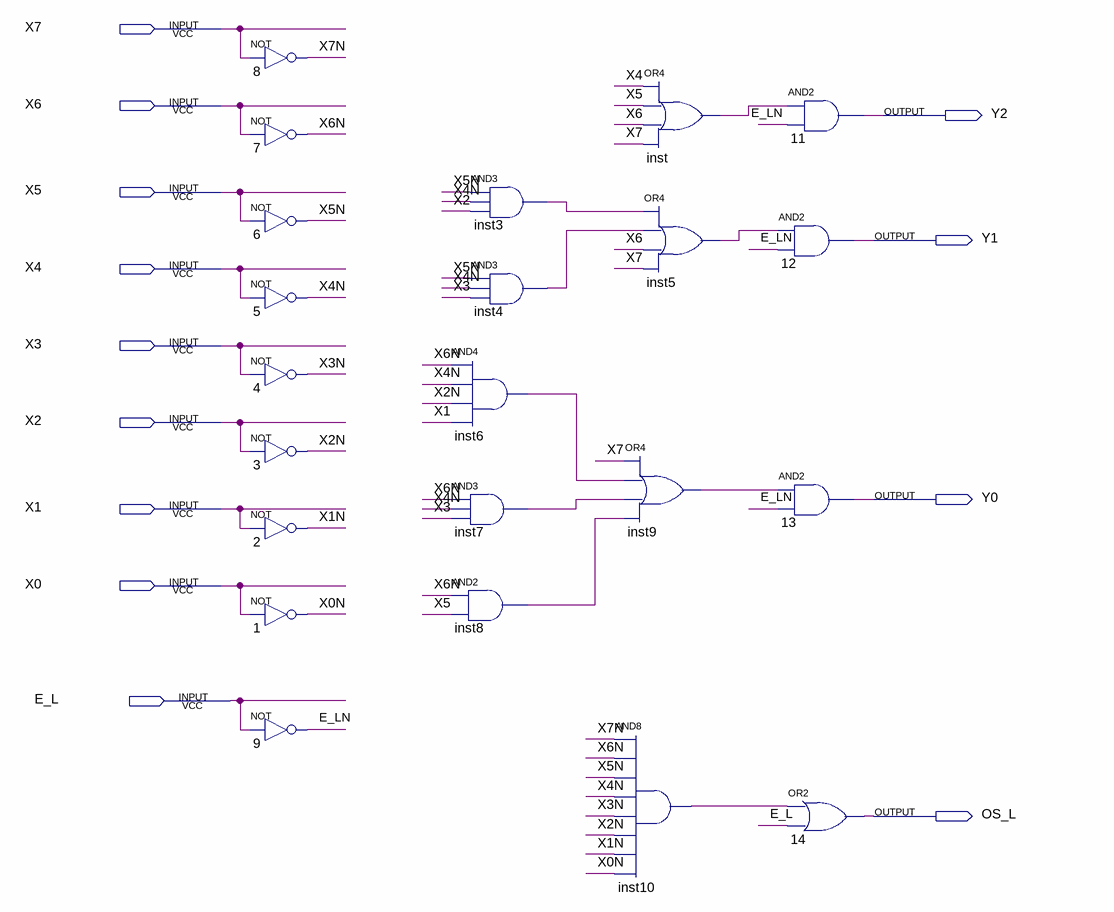
[diagram p0: schematic sheet]
// Quartus schematic PEnc8_3.bdf as structural Verilog: 22 symbols, 13 pins
module PEnc8_3 (
  input  X7,
  input  X6,
  input  X5,
  input  X4,
  input  X3,
  input  X2,
  input  X1,
  input  X0,
  input  E_L,
  output Y2,
  output Y1,
  output Y0,
  output OS_L
);

  wire E_LN, inst3_out, inst4_out, inst5_out, inst6_out, inst7_out, inst8_out, inst9_out, inst10_out,
       inst_out, X0N, X1N, X2N, X3N, X4N, X5N, X6N, X7N;

  not u_8 (X7N, X7);
  not u_7 (X6N, X6);
  not u_6 (X5N, X5);
  not u_5 (X4N, X4);
  not u_4 (X3N, X3);
  not u_3 (X2N, X2);
  not u_2 (X1N, X1);
  not u_1 (X0N, X0);
  not u_9 (E_LN, E_L);
  and inst3 (inst3_out, X5N, X4N, X2);
  and inst4 (inst4_out, X5N, X4N, X3);
  and inst6 (inst6_out, X6N, X4N, X2N, X1);
  and inst7 (inst7_out, X6N, X4N, X3);
  and inst8 (inst8_out, X6N, X5);
  or inst (inst_out, X4, X5, X6, X7);
  or inst5 (inst5_out, inst3_out, inst4_out, X6, X7);
  or inst9 (inst9_out, X7, inst6_out, inst7_out, inst8_out);
  and inst10 (inst10_out, X7N, X6N, X5N, X4N, X3N, X2N, X1N, X0N);
  and u_11 (Y2, inst_out, E_LN);
  and u_12 (Y1, inst5_out, E_LN);
  and u_13 (Y0, inst9_out, E_LN);
  or u_14 (OS_L, inst10_out, E_L);
endmodule
